# Altium schematic sheet A7_GND.SchDoc
size A3
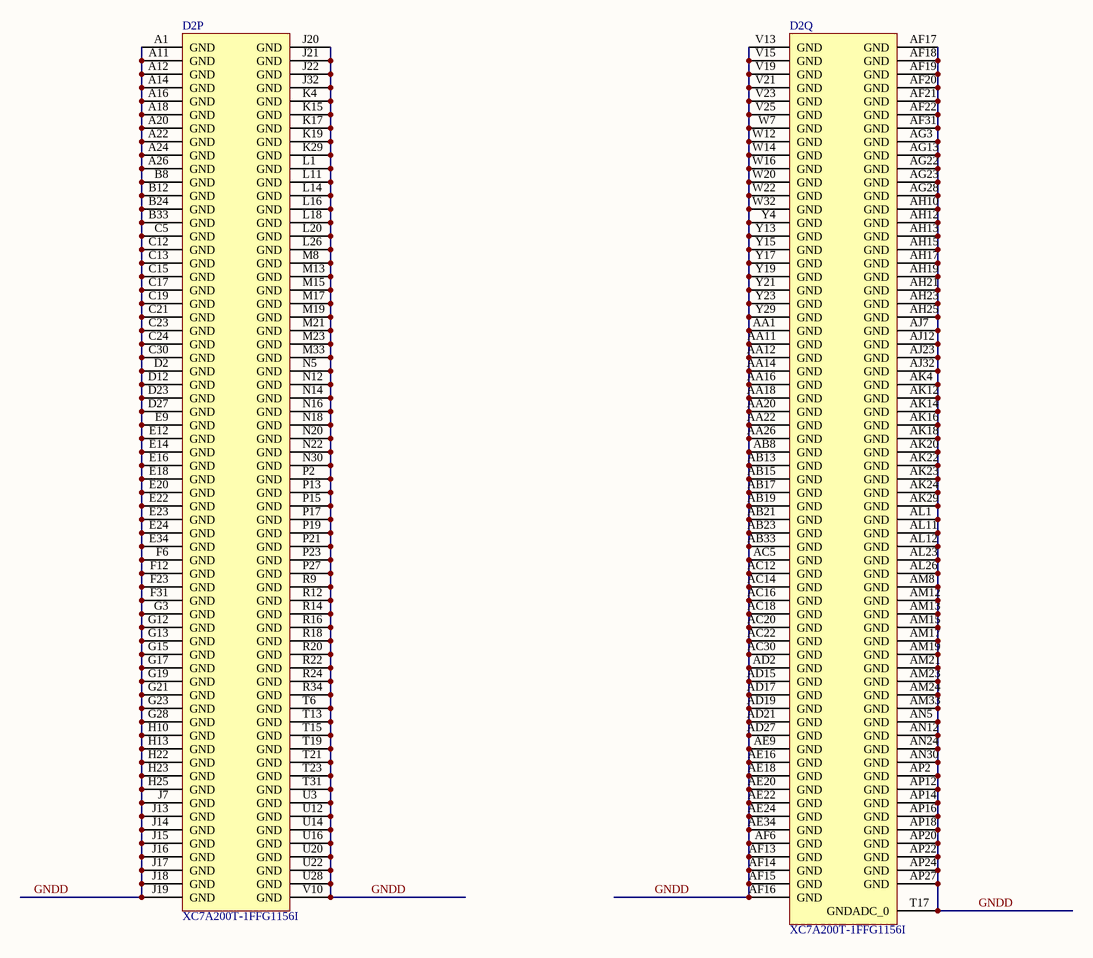
[diagram p0: A7_GND.SchDoc]

## Parts
D2  XC7A200T-1FFG1156I  [FFG1156]  (parts P,Q of 18)

## Nets
GNDD: D2.A1(GND) D2.A11(GND) D2.A12(GND) D2.A14(GND) D2.A16(GND) D2.A18(GND) D2.A20(GND) D2.A22(GND) D2.A24(GND) D2.A26(GND) D2.AA1(GND) D2.AA11(GND) D2.AA12(GND) D2.AA14(GND) D2.AA16(GND) D2.AA18(GND) D2.AA20(GND) D2.AA22(GND) D2.AA26(GND) D2.AB8(GND) D2.AB13(GND) D2.AB15(GND) D2.AB17(GND) D2.AB19(GND) D2.AB21(GND) D2.AB23(GND) D2.AB33(GND) D2.AC5(GND) D2.AC12(GND) D2.AC14(GND) D2.AC16(GND) D2.AC18(GND) D2.AC20(GND) D2.AC22(GND) D2.AC30(GND) D2.AD2(GND) D2.AD15(GND) D2.AD17(GND) D2.AD19(GND) D2.AD21(GND) D2.AD27(GND) D2.AE9(GND) D2.AE16(GND) D2.AE18(GND) D2.AE20(GND) D2.AE22(GND) D2.AE24(GND) D2.AE34(GND) D2.AF6(GND) D2.AF13(GND) D2.AF14(GND) D2.AF15(GND) D2.AF16(GND) D2.AF17(GND) D2.AF18(GND) D2.AF19(GND) D2.AF20(GND) D2.AF21(GND) D2.AF22(GND) D2.AF31(GND) D2.AG3(GND) D2.AG13(GND) D2.AG22(GND) D2.AG23(GND) D2.AG28(GND) D2.AH10(GND) D2.AH12(GND) D2.AH13(GND) D2.AH15(GND) D2.AH17(GND) D2.AH19(GND) D2.AH21(GND) D2.AH23(GND) D2.AH25(GND) D2.AJ7(GND) D2.AJ12(GND) D2.AJ23(GND) D2.AJ32(GND) D2.AK4(GND) D2.AK12(GND) D2.AK14(GND) D2.AK16(GND) D2.AK18(GND) D2.AK20(GND) D2.AK22(GND) D2.AK23(GND) D2.AK24(GND) D2.AK29(GND) D2.AL1(GND) D2.AL11(GND) D2.AL12(GND) D2.AL23(GND) D2.AL26(GND) D2.AM8(GND) D2.AM12(GND) D2.AM13(GND) D2.AM15(GND) D2.AM17(GND) D2.AM19(GND) D2.AM21(GND) D2.AM23(GND) D2.AM24(GND) D2.AM33(GND) D2.AN5(GND) D2.AN12(GND) D2.AN24(GND) D2.AN30(GND) D2.AP2(GND) D2.AP12(GND) D2.AP14(GND) D2.AP16(GND) D2.AP18(GND) D2.AP20(GND) D2.AP22(GND) D2.AP24(GND) D2.AP27(GND) D2.B8(GND) D2.B12(GND) D2.B24(GND) D2.B33(GND) D2.C5(GND) D2.C12(GND) D2.C13(GND) D2.C15(GND) D2.C17(GND) D2.C19(GND) D2.C21(GND) D2.C23(GND) D2.C24(GND) D2.C30(GND) D2.D2(GND) D2.D12(GND) D2.D23(GND) D2.D27(GND) D2.E9(GND) D2.E12(GND) D2.E14(GND) D2.E16(GND) D2.E18(GND) D2.E20(GND) D2.E22(GND) D2.E23(GND) D2.E24(GND) D2.E34(GND) D2.F6(GND) D2.F12(GND) D2.F23(GND) D2.F31(GND) D2.G3(GND) D2.G12(GND) D2.G13(GND) D2.G15(GND) D2.G17(GND) D2.G19(GND) D2.G21(GND) D2.G23(GND) D2.G28(GND) D2.H10(GND) D2.H13(GND) D2.H22(GND) D2.H23(GND) D2.H25(GND) D2.J7(GND) D2.J13(GND) D2.J14(GND) D2.J15(GND) D2.J16(GND) D2.J17(GND) D2.J18(GND) D2.J19(GND) D2.J20(GND) D2.J21(GND) D2.J22(GND) D2.J32(GND) D2.K4(GND) D2.K15(GND) D2.K17(GND) D2.K19(GND) D2.K29(GND) D2.L1(GND) D2.L11(GND) D2.L14(GND) D2.L16(GND) D2.L18(GND) D2.L20(GND) D2.L26(GND) D2.M8(GND) D2.M13(GND) D2.M15(GND) D2.M17(GND) D2.M19(GND) D2.M21(GND) D2.M23(GND) D2.M33(GND) D2.N5(GND) D2.N12(GND) D2.N14(GND) D2.N16(GND) D2.N18(GND) D2.N20(GND) D2.N22(GND) D2.N30(GND) D2.P2(GND) D2.P13(GND) D2.P15(GND) D2.P17(GND) D2.P19(GND) D2.P21(GND) D2.P23(GND) D2.P27(GND) D2.R9(GND) D2.R12(GND) D2.R14(GND) D2.R16(GND) D2.R18(GND) D2.R20(GND) D2.R22(GND) D2.R24(GND) D2.R34(GND) D2.T6(GND) D2.T13(GND) D2.T15(GND) D2.T17(GNDADC_0) D2.T19(GND) D2.T21(GND) D2.T23(GND) D2.T31(GND) D2.U3(GND) D2.U12(GND) D2.U14(GND) D2.U16(GND) D2.U20(GND) D2.U22(GND) D2.U28(GND) D2.V10(GND) D2.V13(GND) D2.V15(GND) D2.V19(GND) D2.V21(GND) D2.V23(GND) D2.V25(GND) D2.W7(GND) D2.W12(GND) D2.W14(GND) D2.W16(GND) D2.W20(GND) D2.W22(GND) D2.W32(GND) D2.Y4(GND) D2.Y13(GND) D2.Y15(GND) D2.Y17(GND) D2.Y19(GND) D2.Y21(GND) D2.Y23(GND) D2.Y29(GND)

## Library data of the parts
D2 = XC7A200T-1FFG1156I: Artix-7 FPGA, 500 User I/Os, 16 GTP, 1156-Ball BGA, Speed Grade 1, Industrial Grade, Pb-Free; Manufacturer: Xilinx; Block RAM Blocks (18Kb): 730; Block RAM Blocks (36Kb): 365; Block RAM Blocks (Max Kb): 13140; CLBs (Slices): 33650; Clock Mgmt Tiles (CMTs): 10; DSP48E1 Slices: 740; Logic Cells: 215360; Max User I/O: 500; Speed Grade: -1; DatasheetVersion: v1.12; PackageVersion: Rev 1.8; PackageReference: FFG1156; PackageDescription: Flip-Chip BGA, Body 35 x 35 mm, 1.0 mm Pitch; CLBs (Max Distributed RAM Kb): 2888; Generic Part Number: XC7A200T; RoHS: Pb-Free; Mounting Technology: Surface Mount; Code_JEDEC: MS-034-AAR-1; PartNumber: XC7A200T-1FFG1156I; ComponentLink1Description: Datasheet; ComponentLink1URL: http://www.xilinx.com/support/documentation/data_sheets/ds180_7Series_Overview.pdf; ComponentLink2Description: Package Specification; ComponentLink2URL: http://www.xilinx.com/support/documentation/user_guides/ug475_7Series_Pkg_Pinout.pdf; ComponentLink3Description: DC and Switching Characteristics; ComponentLink3URL: http://www.xilinx.com/support/documentation/data_sheets/ds181_Artix_7_Data_Sheet.pdf; ComponentLink4Description: Package File; ComponentLink4URL: http://www.xilinx.com/support/packagefiles/a7packages/xc7a200tfbg676pkg.txt; ComponentLink5Description: Packaging and Pinout; ComponentLink5URL: http://www.xilinx.com/support/documentation/user_guides/ug475_7Series_Pkg_Pinout.pdf